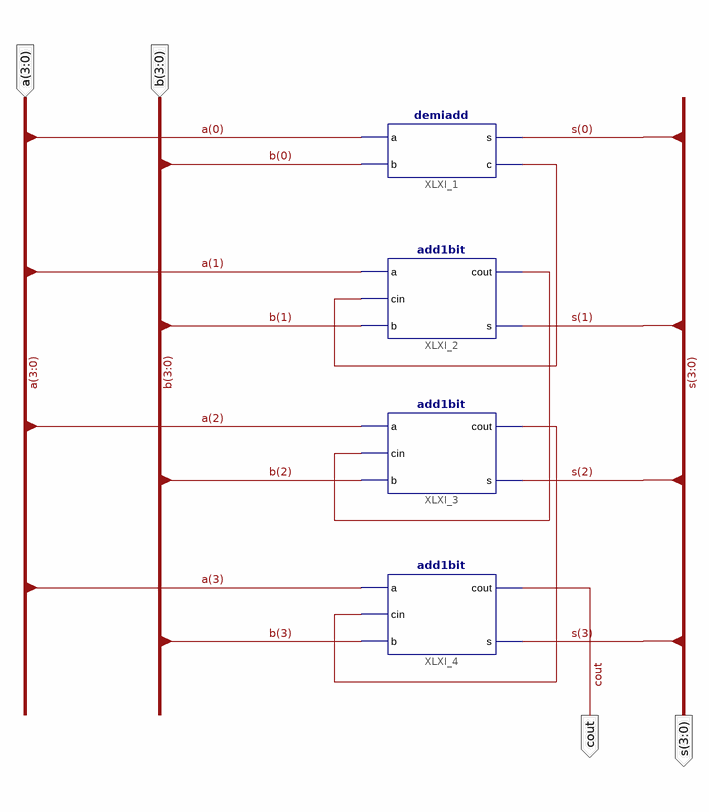
[diagram p0: schematic sheet 1]
// Xilinx ISE schematic add4bit.sch (spartan3e) as structural Verilog: 4 symbols, 4 ports
module add4bit (
  input  [3:0] b,
  input  [3:0] a,
  output [3:0] s,
  output cout
);

  wire XLXN_12, XLXN_15, XLXN_16;

  demiadd XLXI_1 (.a(a[0]), .b(b[0]), .s(s[0]), .c(XLXN_12));
  add1bit XLXI_2 (.a(a[1]), .cin(XLXN_12), .b(b[1]), .cout(XLXN_15), .s(s[1]));
  add1bit XLXI_3 (.a(a[2]), .cin(XLXN_15), .b(b[2]), .cout(XLXN_16), .s(s[2]));
  add1bit XLXI_4 (.a(a[3]), .cin(XLXN_16), .b(b[3]), .cout(cout), .s(s[3]));
endmodule
